# EAGLE design precharge (EAGLE 6.5.0)
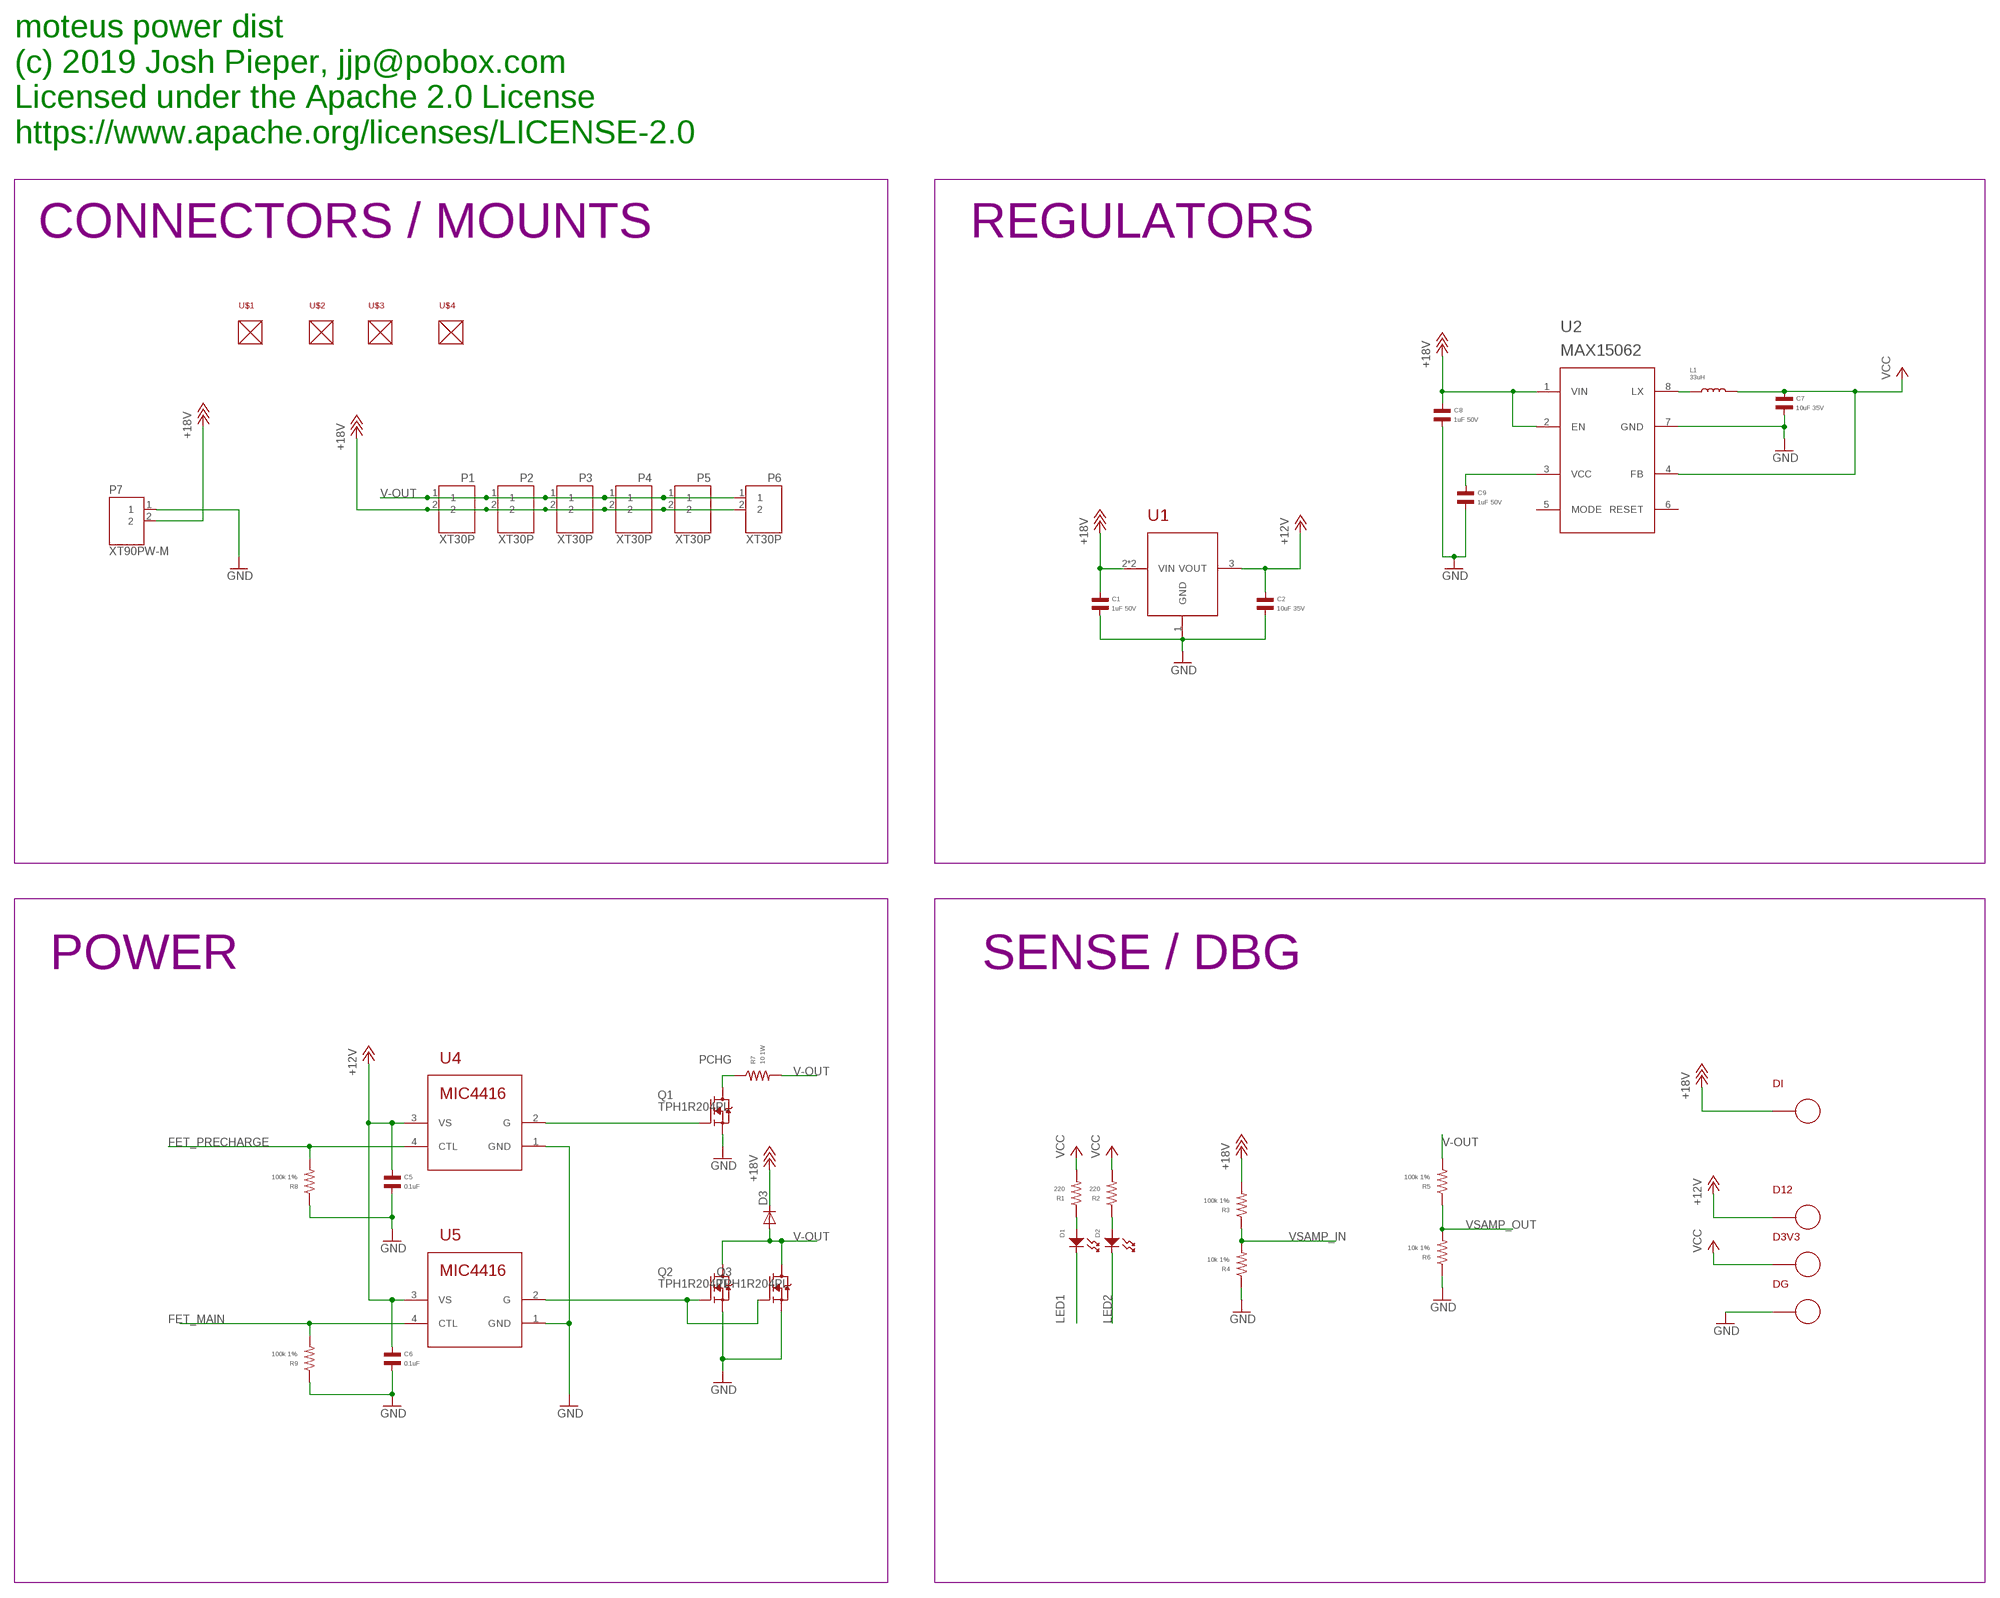
[diagram p0: schematic, sheet 1, part 1 of 2]
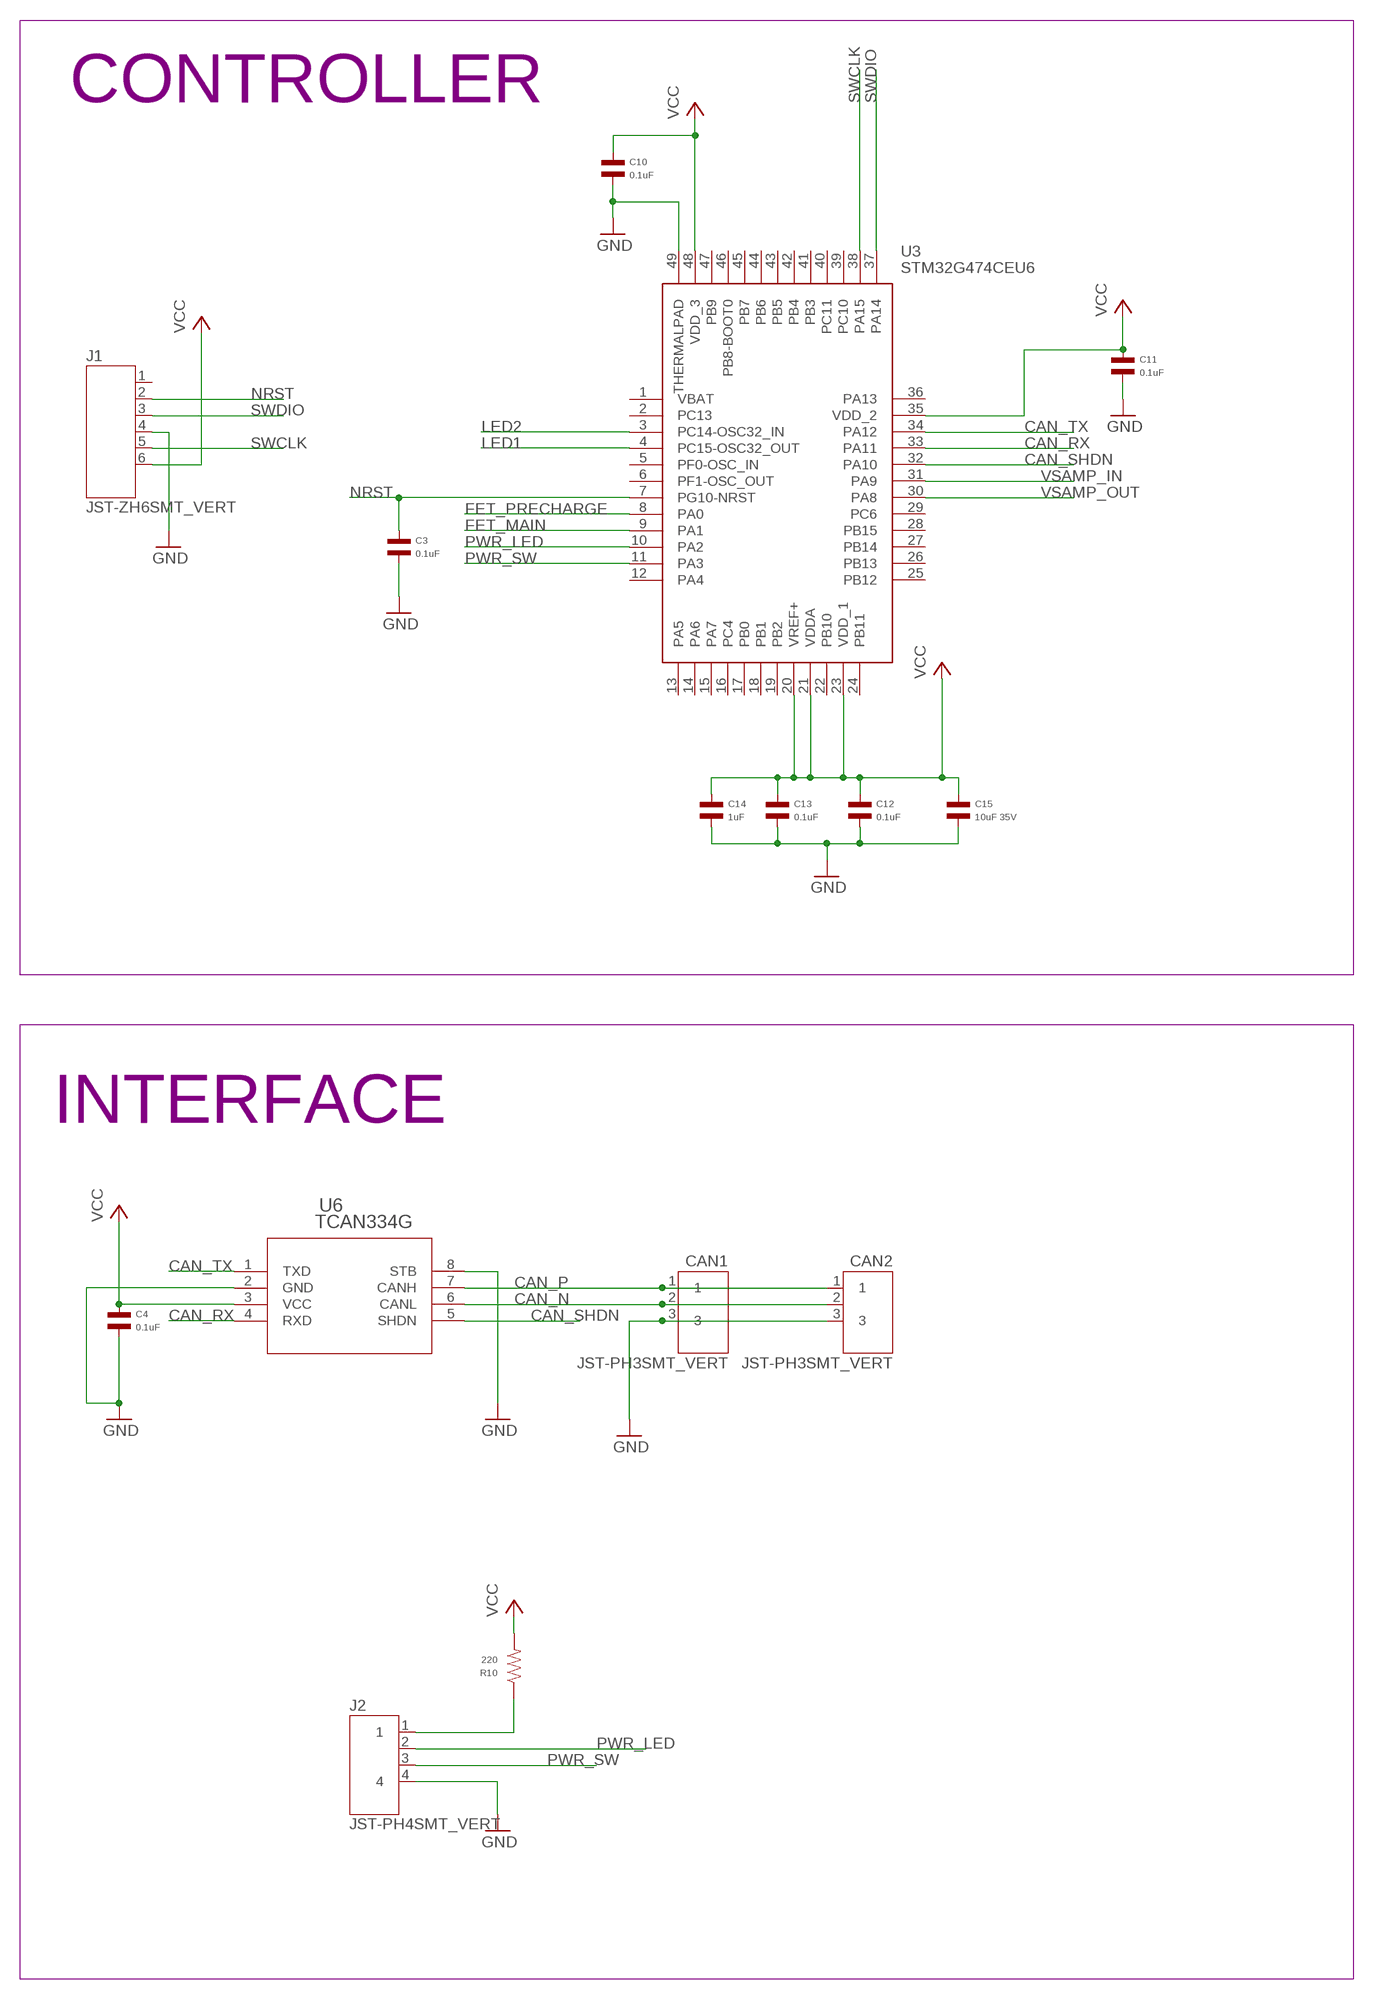
[diagram p1: schematic, sheet 1, part 2 of 2]

## Parts
C1  1uF 50V  CAPACITOR_NP_0603  [C0603]
C2  10uF 35V  CAPACITOR_NP_1206  [C1206]
C3  0.1uF  CAPACITOR_NP_0402  [C0402]
C4  0.1uF  CAPACITOR_NP_0402  [C0402]
C5  0.1uF  CAPACITOR_NP_0402  [C0402]
C6  0.1uF  CAPACITOR_NP_0402  [C0402]
C7  10uF 35V  CAPACITOR_NP_1206  [C1206]
C8  1uF 50V  CAPACITOR_NP_0603  [C0603]
C9  1uF 50V  CAPACITOR_NP_0603  [C0603]
C10  0.1uF  CAPACITOR_NP_0402  [C0402]
C11  0.1uF  CAPACITOR_NP_0402  [C0402]
C12  0.1uF  CAPACITOR_NP_0402  [C0402]
C13  0.1uF  CAPACITOR_NP_0402  [C0402]
C14  1uF  CAPACITOR_NP_0402  [C0402]
C15  10uF 35V  CAPACITOR_NP_1206  [C1206]
CAN1  JST-PH3SMT_VERT  [JST_B3B_PH-SM4-TB(LF)(SN)]
CAN2  JST-PH3SMT_VERT  [JST_B3B_PH-SM4-TB(LF)(SN)]
D1  LED_SINGLE-0603  [LED0603]
D2  LED_SINGLE-0603  [LED0603]
D3  DIODE-  [DO-214AB]
D3V3  PAD24AWG_PAD  [24AWG_PAD]
D12  PAD24AWG_PAD  [24AWG_PAD]
DG  PAD24AWG_PAD  [24AWG_PAD]
DI  PAD24AWG_PAD  [24AWG_PAD]
J1  JST-ZH6SMT_VERT  [JST_B6B-ZR-SM4-TF(LF)(SN)]
J2  JST-PH4SMT_VERT  [JST_B4B_PH-SM4-TB(LF)(SN)]
L1  33uH  INDUCTOR_1210  [L1210]
P1  XT30P  [XT30P]
P2  XT30P  [XT30P]
P3  XT30P  [XT30P]
P4  XT30P  [XT30P]
P5  XT30P  [XT30P]
P6  XT30P  [XT30P]
P7  XT90PW-M  [XT90PW-M]
Q1  TPH1R204PL  [SOP_ADVANCE]
Q2  TPH1R204PL  [SOP_ADVANCE]
Q3  TPH1R204PL  [SOP_ADVANCE]
R1  220  RESISTOR_0603  [R0603]
R2  220  RESISTOR_0603  [R0603]
R3  100k 1%  RESISTOR_0603  [R0603]
R4  10k 1%  RESISTOR_0603  [R0603]
R5  100k 1%  RESISTOR_0603  [R0603]
R6  10k 1%  RESISTOR_0603  [R0603]
R7  10 1W  RESISTOR_1206  [R1206]
R8  100k 1%  RESISTOR_0603  [R0603]
R9  100k 1%  RESISTOR_0603  [R0603]
R10  220  RESISTOR_0603  [R0603]
U1  ZXTR2012Z  [SOT89]
U2  MAX150628TDFN  [8TDFN]
U3  STM32G474CEU6  [QFN50P700X700X60-49N]
U4  MIC4416  [SOT143]
U5  MIC4416  [SOT143]
U6  TCAN334G  [SOIC8]
U$1  MOUNT  [M2.5MOUNT]
U$2  MOUNT  [M2.5MOUNT]
U$3  MOUNT  [M2.5MOUNT]
U$4  MOUNT  [M2.5MOUNT]

## Nets
+12V [power]: C2.P$1 C5.P$1 C6.P$1 D12.P$1 U1.3(VOUT) U4.3(VS) U5.3(VS)
+18V: C1.P$1 C8.P$1 D3.C DI.P$1 P1.2 P2.2 P3.2 P4.2 P5.2 P6.2 P7.2 R3.P$2 U1.2(VIN) U1.PAD(VIN) U2.1(VIN) U2.2(EN)
CAN_N: CAN1.2 CAN2.2 U6.6(CANL)
CAN_P: CAN1.1 CAN2.1 U6.7(CANH)
CAN_RX: U3.33(PA11) U6.4(RXD)
CAN_SHDN: U3.32(PA10) U6.5(SHDN)
CAN_TX: U3.34(PA12) U6.1(TXD)
FET_MAIN: R9.P$2 U3.9(PA1) U5.4(CTL)
FET_PRECHARGE: R8.P$2 U3.8(PA0) U4.4(CTL)
GND: C1.P$2 C2.P$2 C3.P$2 C4.P$2 C5.P$2 C6.P$2 C7.P$2 C8.P$2 C9.P$2 C10.P$2 C11.P$2 C12.P$2 C13.P$2 C14.P$2 C15.P$2 CAN1.3 CAN2.3 DG.P$1 J1.4 J2.4 P7.1 Q1.1(S) Q1.2(S) Q1.3(S) Q2.1(S) Q2.2(S) Q2.3(S) Q3.1(S) Q3.2(S) Q3.3(S) R4.P$1 R6.P$1 R8.P$1 R9.P$1 U1.1(GND) U2.7(GND) U3.49(THERMALPAD) U4.1(GND) U5.1(GND) U6.2(GND) U6.8(STB)
LED1: D1.CATHODE U3.4(PC15-OSC32_OUT)
LED2: D2.CATHODE U3.3(PC14-OSC32_IN)
LX: L1.P$1 U2.8(LX)
N$1: D1.ANODE R1.P$1
N$2: J2.1 R10.P$1
N$3: Q2.4(G) Q3.4(G) U5.2(G)
N$4: D2.ANODE R2.P$1
N$12: Q1.4(G) U4.2(G)
N$13: C9.P$1 U2.3(VCC)
NRST: C3.P$1 J1.2 U3.7(PG10-NRST)
PCHG: Q1.5(D) Q1.6(D) Q1.7(D) Q1.8(D) Q1.PAD(D) R7.P$1
PWR_LED: J2.2 U3.10(PA2)
PWR_SW: J2.3 U3.11(PA3)
SWCLK: J1.5 U3.38(PA15)
SWDIO: J1.3 U3.37(PA14)
V-OUT: D3.A P1.1 P2.1 P3.1 P4.1 P5.1 P6.1 Q2.5(D) Q2.6(D) Q2.7(D) Q2.8(D) Q2.PAD(D) Q3.5(D) Q3.6(D) Q3.7(D) Q3.8(D) Q3.PAD(D) R5.P$2 R7.P$2
VCC [power]: C4.P$1 C7.P$1 C10.P$1 C11.P$1 C12.P$1 C13.P$1 C14.P$1 C15.P$1 D3V3.P$1 J1.6 L1.P$2 R1.P$2 R2.P$2 R10.P$2 U2.4(FB) U3.20(VREF+) U3.21(VDDA) U3.23(VDD_1) U3.35(VDD_2) U3.48(VDD_3) U6.3(VCC)
VSAMP_IN: R3.P$1 R4.P$2 U3.31(PA9)
VSAMP_OUT: R5.P$1 R6.P$2 U3.30(PA8)
Unconnected: J1.1 U2.5(MODE) U2.6(RESET) U3.1(VBAT) U3.2(PC13) U3.5(PF0-OSC_IN) U3.6(PF1-OSC_OUT) U3.12(PA4) U3.13(PA5) U3.14(PA6) U3.15(PA7) U3.16(PC4) U3.17(PB0) U3.18(PB1) U3.19(PB2) U3.22(PB10) U3.24(PB11) U3.25(PB12) U3.26(PB13) U3.27(PB14) U3.28(PB15) U3.29(PC6) U3.36(PA13) U3.39(PC10) U3.40(PC11) U3.41(PB3) U3.42(PB4) U3.43(PB5) U3.44(PB6) U3.45(PB7) U3.46(PB8-BOOT0) U3.47(PB9)

## Notes on the sheet
- moteus power dist
  (c) 2019 Josh Pieper, jjp@pobox.com
  Licensed under the Apache 2.0 License
  https://www.apache.org/licenses/LICENSE-2.0
- CONNECTORS / MOUNTS | REGULATORS | CONTROLLER
- POWER | SENSE / DBG | INTERFACE

## Library data of the parts
C1 C8 C9 = mfpassives:CAPACITOR_NP: Library: MF_Passives Description: Device for Non-Polarized Capacitors. Manufacture part number (MPN) can be added via Attributes. Check https://factory.macrofab.com/parts for the house parts list.; MF: SAMSUNG; MPN: CL10A105KB8NNNC; POPULATE: 1
C2 C7 C15 = mfpassives:CAPACITOR_NP: Library: MF_Passives Description: Device for Non-Polarized Capacitors. Manufacture part number (MPN) can be added via Attributes. Check https://factory.macrofab.com/parts for the house parts list.; MF: TDK; MPN: CGA5L1X7R1V106K160AC; POPULATE: 1
C3-C6 C10-C13 = mfpassives:CAPACITOR_NP: Library: MF_Passives Description: Device for Non-Polarized Capacitors. Manufacture part number (MPN) can be added via Attributes. Check https://factory.macrofab.com/parts for the house parts list.; HOUSEPART: 1; MPN: MF-CAP-0402-0.1uF; POPULATE: 1
C14 = mfpassives:CAPACITOR_NP: Library: MF_Passives Description: Device for Non-Polarized Capacitors. Manufacture part number (MPN) can be added via Attributes. Check https://factory.macrofab.com/parts for the house parts list.; HOUSEPART: 1; MPN: MF-CAP-0402-1uF; POPULATE: 1
CAN1 CAN2 = precharge:JST-PH3; MF: JST; MPN: B3B-PH-SM4-TB(LF)(SN); POPULATE: 1
D1 D2 = mfleds:LED_SINGLE: Library: MF_LEDs Description: Device for Single LED Packages. Manufacture part number (MFG#) can be added via Attributes.; HOUSEPART: 1; MPN: MF-LED-0603-RED; POPULATE: 1
D3 = imu_junction:DIODE-: DIODE; MF: MICRO COMMERCIAL; MPN: SK510L-TP; POPULATE: 1
D3V3 D12 DG DI = precharge:PAD; POPULATE: 0
J1 = precharge:JST-ZH6; MF: JST; MPN: B6B-ZR-SM4-TF(LF)(SN); POPULATE: 1
J2 = precharge:JST-PH4; MF: JST; MPN: B4B-PH-SM4-TB(LF)(SN); POPULATE: 1
L1 = mfpassives:INDUCTOR: Library: MF_Passives Description: Device for Inductors. Manufacture part number (MPN) can be added via Attributes. Check https://factory.macrofab.com/parts for the house parts list.; MF: TDK; MPN: NLFV32T-330K-EF; POPULATE: 1
P1-P6 = precharge:XT30; POPULATE: 0
P7 = precharge:XT90; POPULATE: 0
Q1-Q3 = imu_junction:TPH1R204PL; MF: Toshiba; MPN: TPH1R204PL,L1Q; POPULATE: 1
R1 R2 R10 = mfpassives:RESISTOR: Library: MF_Passives Description: Device for Resistors. Manufacture part number (MPN), Voltage, Tolerance, and Wattage Rating can be added via Attributes. Check https://factory.macrofab.com/parts for the house parts list.; HOUSEPART: 1; MPN: MF-RES-0603-220; POPULATE: 1
R3 R5 R8 R9 = mfpassives:RESISTOR: Library: MF_Passives Description: Device for Resistors. Manufacture part number (MPN), Voltage, Tolerance, and Wattage Rating can be added via Attributes. Check https://factory.macrofab.com/parts for the house parts list.; MF: VISHAY; MPN: CRCW0603100KFKEA; POPULATE: 1
R4 R6 = mfpassives:RESISTOR: Library: MF_Passives Description: Device for Resistors. Manufacture part number (MPN), Voltage, Tolerance, and Wattage Rating can be added via Attributes. Check https://factory.macrofab.com/parts for the house parts list.; MF: PANASONIC; MPN: P10.0KHDKR-ND; POPULATE: 1
R7 = mfpassives:RESISTOR: Library: MF_Passives Description: Device for Resistors. Manufacture part number (MPN), Voltage, Tolerance, and Wattage Rating can be added via Attributes. Check https://factory.macrofab.com/parts for the house parts list.; MF: Susumu; MPN: HRG3216Q-10R0-D-T1; POPULATE: 1
U1 = imu_junction:ZXTR2012Z; MF: DIODES INC; MPN: ZXTR2012Z-13; POPULATE: 1
U2 = precharge:MAX15062; MF: MAXIM; MPN: MAX15062AATA+T; POPULATE: 1
U3 = precharge:STM32G474CEU6: STMICROELECTRONICS - STM32G474CEU6 - MCU, 32BIT, 170MHZ, UFQFPN-48 Source: Datasheet <https://componentsearchengine.com/Datasheets/1/STM32G474CEU6.pdf>; DESCRIPTION: STMICROELECTRONICS - STM32G474CEU6 - MCU, 32BIT, 170MHZ, UFQFPN-48; HEIGHT: 0.6mm; MANUFACTURER_NAME: STMicroelectronics; MANUFACTURER_PART_NUMBER: STM32G474CEU6; MF: ST; MOUSER_PART_NUMBER: 511-STM32G474CEU6; MOUSER_PRICE-STOCK: https://www.mouser.com/Search/Refine.aspx?Keyword=511-STM32G474CEU6; MPN: STM32G474CEU6; POPULATE: 1
U4 U5 = imu_junction:MIC4416; MF: MICROCHIP; MPN: MIC4416YM4-TR; POPULATE: 1
U6 = precharge:TCAN334G; MF: TI; MPN: TCAN334GDR; POPULATE: 1
U$1-U$4 = precharge:MOUNT; POPULATE: 0

## Net classes
1 power: width 0.254 mm

## Board
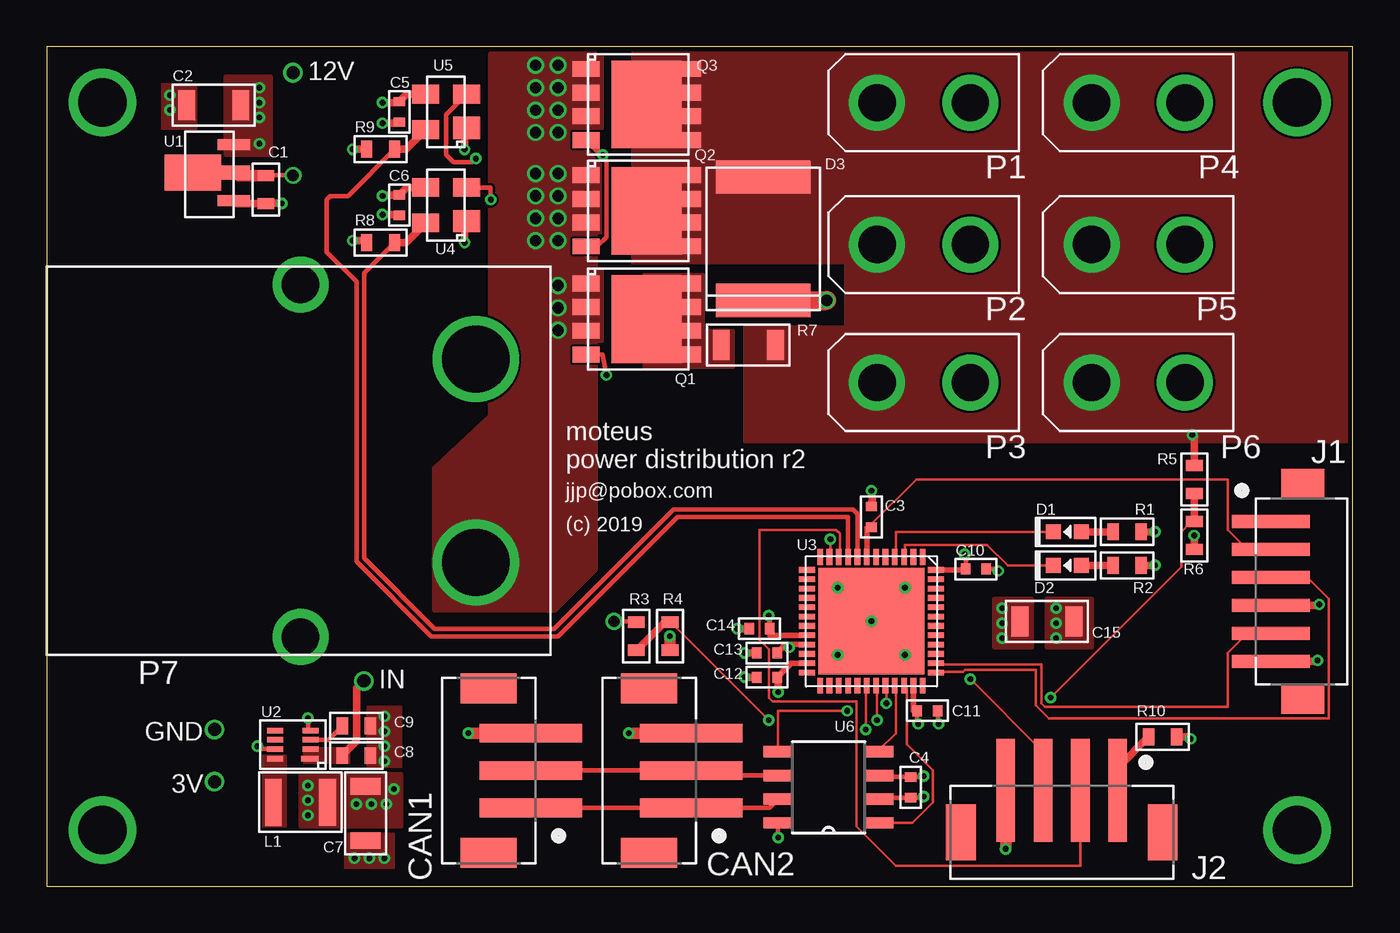
[diagram p2: board, top side]
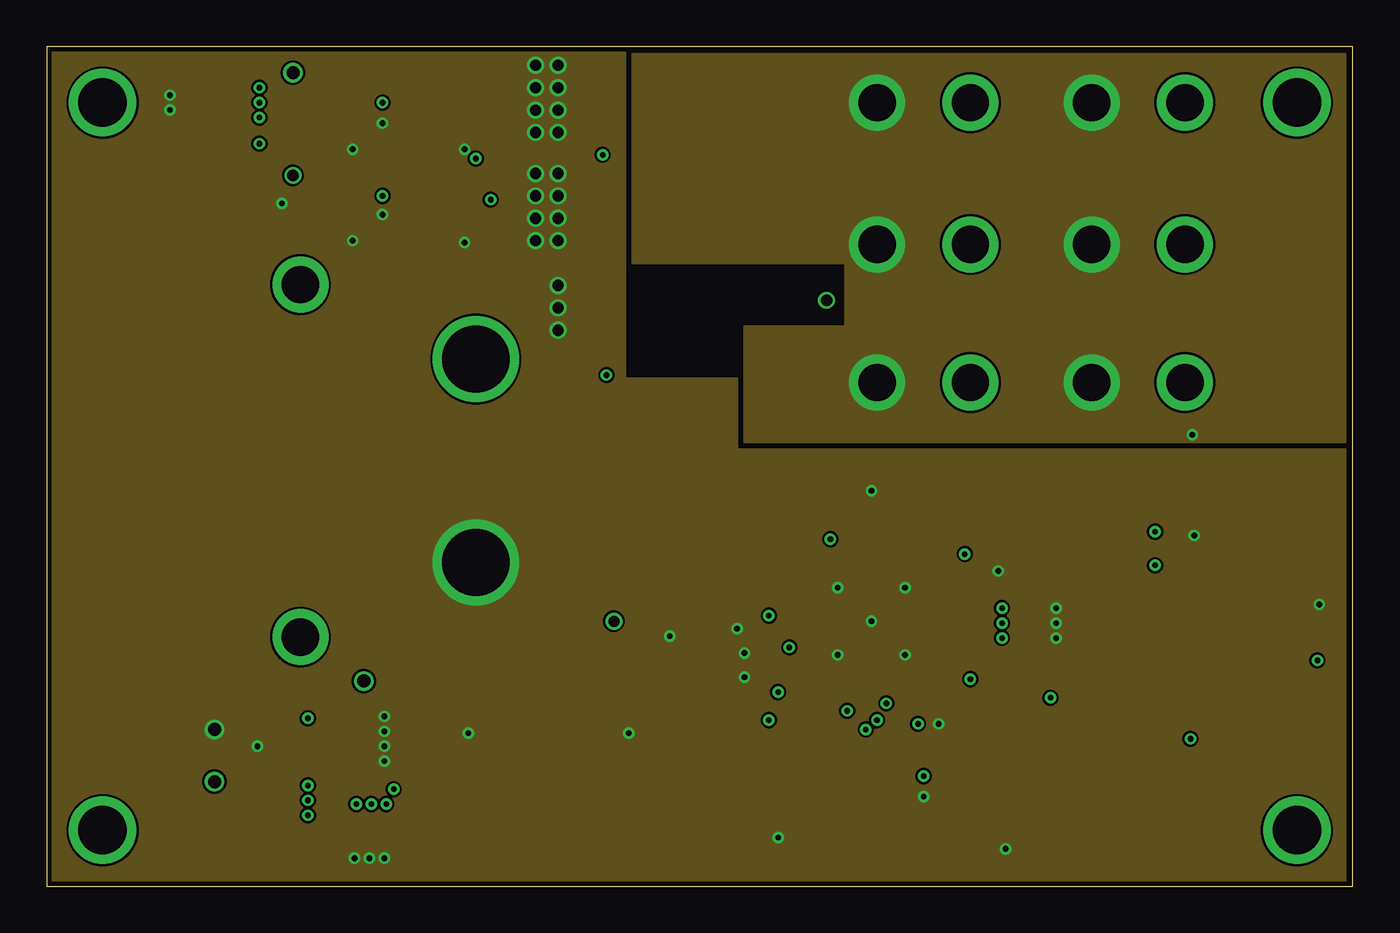
[diagram p3: board, inner layer Route2]
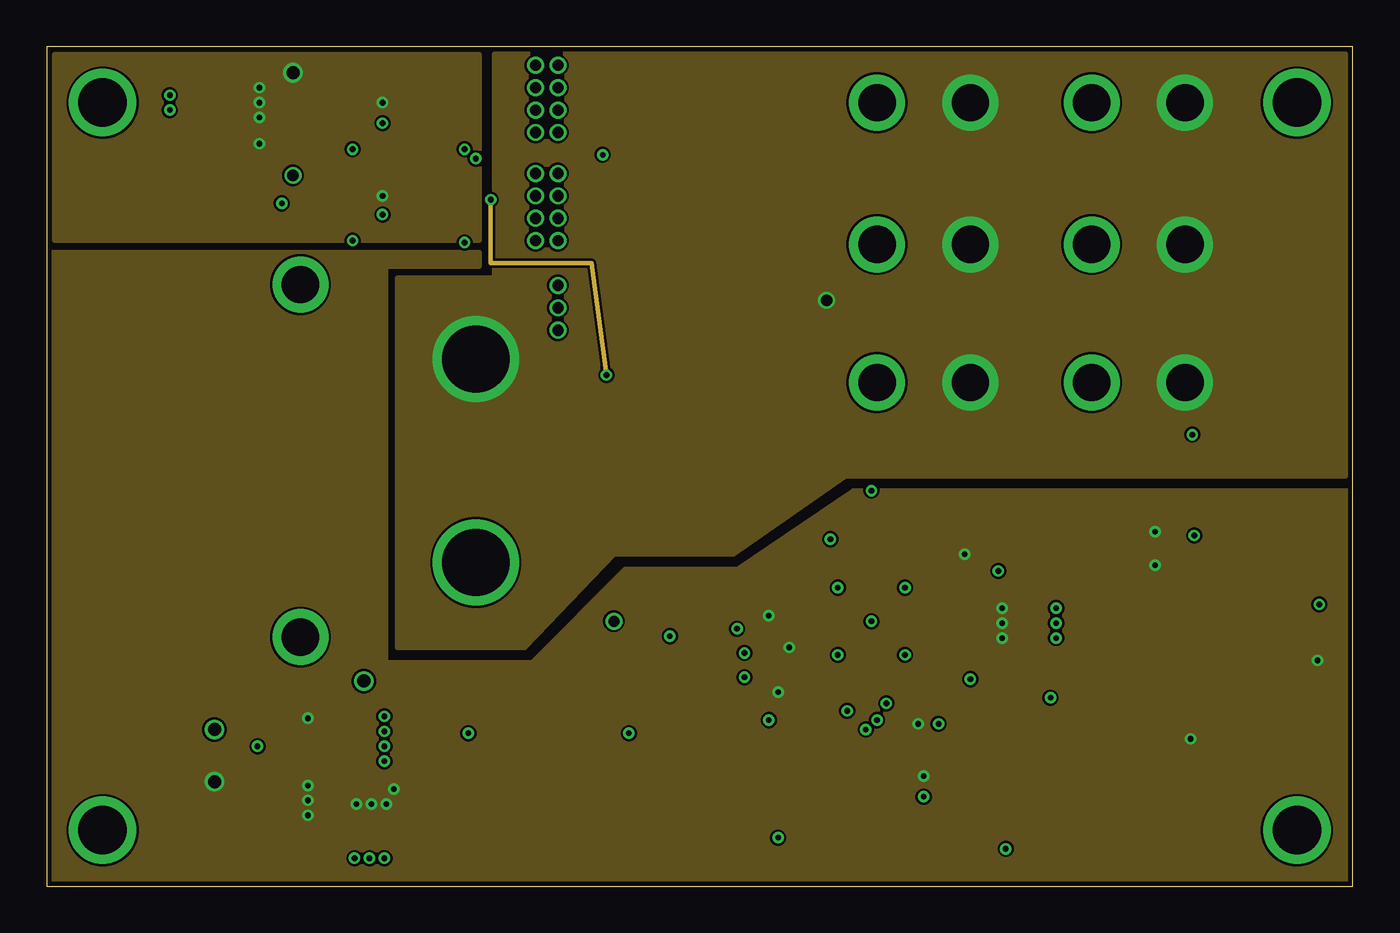
[diagram p4: board, inner layer Route15]
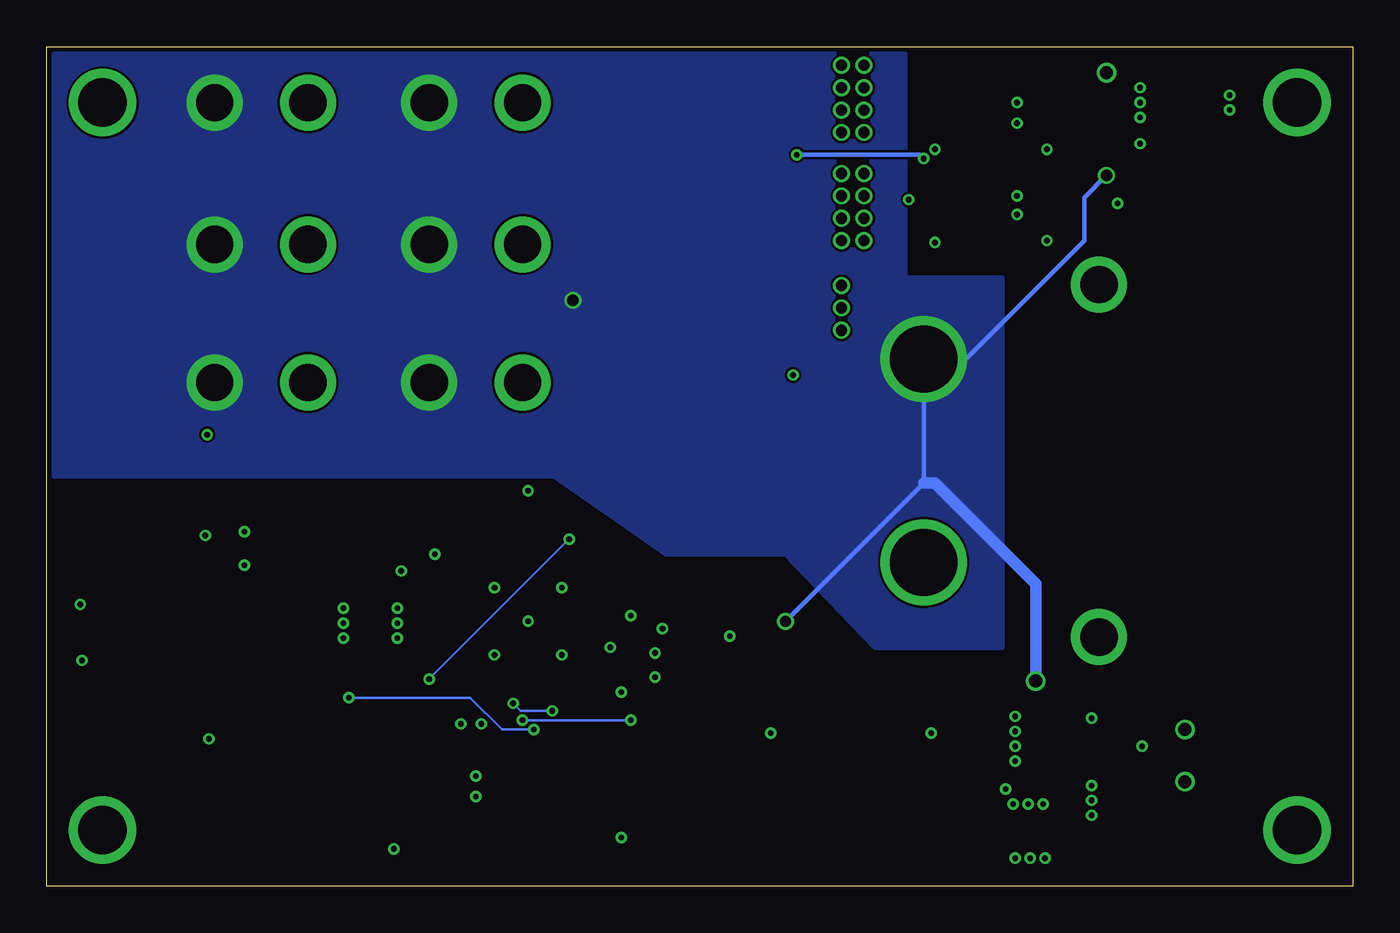
[diagram p5: board, bottom side, seen from below]

Size 70 x 45 mm. Coordinates in mm from the lower left corner, seen from the top.
Outline: 0,0 70,0 70,45 0,45 0,0
Copper layers (1*2*15*16): Top 0.035mm / dielectric 0.23mm / Route2 0.035mm / dielectric 0.93mm / Route15 0.035mm / dielectric 0.23mm / Bottom 0.035mm
Design rules "MF_Standard_4_Layer": minimum track width 5mil, minimum drill 12mil, track to track 5mil, track to pad 5mil, pad to pad 5mil, via to via 5mil, smd to smd 0mil, copper to edge 10mil, drill to drill 10mil, minimum pad ring 6mil, minimum via ring 6mil, stop-mask expansion 2mil, vias tented up to drill 25mil, thermal gap 10mil

### Footprints (pad centres in the part's own frame; a part is rotated, then mirrored left to right if it is on the bottom)
C0603 = smd 0.6 x 0.9: P$1 -0.75,0; P$2 0.75,0
C1206 = smd 0.9 x 1.6: P$1 -1.45,0; P$2 1.45,0
C0402 = smd 0.5 x 0.6: P$1 -0.55,0; P$2 0.55,0
JST_B3B_PH-SM4-TB(LF)(SN) = smd 1 x 5.5: 1 -2,-2.54; 2 0,-2.54; 3 2,-2.54 | smd 1.6 x 3: P1 -4.4,-0.29; P2 4.4,-0.29
LED0603 = smd 0.8 x 0.8: ANODE 0.75,0; CATHODE -0.75,0
DO-214AB = smd 1.778 x 5.08: A 3.302,0; C -3.302,0
24AWG_PAD = drill 0.7: P$1 0,0
JST_B6B-ZR-SM4-TF(LF)(SN) = smd 0.7 x 4.2: 1 -3.75,-2; 2 -2.25,-2; 3 -0.75,-2; 4 0.75,-2; 5 2.25,-2; 6 3.75,-2 | smd 1.5 x 2.3: P1 -5.8,-0.29; P2 5.8,-0.29
JST_B4B_PH-SM4-TB(LF)(SN) = smd 1 x 5.5: 1 -3,-2.54; 2 -1,-2.54; 3 1,-2.54; 4 3,-2.54 | smd 1.6 x 3: P1 -5.4,-0.29; P2 5.4,-0.29
L1210 = smd 0.9 x 2.5: P$1 -1.45,0; P$2 1.45,0
XT30P = drill 2: 1 -2.5,0; 2 2.5,0
XT90PW-M = drill 3.6: 1 -5.45,0; 2 5.45,0 | drill 2: S1 -9.45,9.4; S2 9.45,9.4
SOP_ADVANCE = smd 0.85 x 1.45: 1 -1.905,-2.8; 2 -0.635,-2.8; 3 0.635,-2.8; 4 1.905,-2.8 | smd 0.85 x 1.05: 5 1.905,2.85; 6 0.635,2.85; 7 -0.635,2.85; 8 -1.905,2.85 | smd 4.7 x 3.75: PAD 0,0.45
R0603 = smd 0.6 x 0.9: P$1 -0.75,0; P$2 0.75,0
R1206 = smd 0.9 x 1.6: P$1 -1.45,0; P$2 1.45,0
SOT89 = smd 0.58 x 1.73: 1 -1.5,-1.2; 3 1.5,-1.2 | smd 0.76 x 1.55: 2 0,-1.29 | smd 1.933 x 3.03: PAD 0,1
8TDFN = smd 0.3 x 0.95: 1 -0.75,-0.9 | smd 0.3 x 0.85: 2 -0.25,-0.95; 3 0.25,-0.95; 4 0.75,-0.95; 5 0.75,0.95; 6 0.25,0.95; 7 -0.25,0.95; 8 -0.75,0.95
QFN50P700X700X60-49N = smd 0.85 x 0.3: 1 -3.45,2.75; 2 -3.45,2.25; 3 -3.45,1.75; 4 -3.45,1.25; 5 -3.45,0.75; 6 -3.45,0.25; 7 -3.45,-0.25; 8 -3.45,-0.75; 9 -3.45,-1.25; 10 -3.45,-1.75; 11 -3.45,-2.25; 12 -3.45,-2.75; 25 3.45,-2.75; 26 3.45,-2.25; 27 3.45,-1.75; 28 3.45,-1.25; 29 3.45,-0.75; 30 3.45,-0.25; 31 3.45,0.25; 32 3.45,0.75; 33 3.45,1.25; 34 3.45,1.75; 35 3.45,2.25; 36 3.45,2.75 | smd 0.3 x 0.85: 13 -2.75,-3.45; 14 -2.25,-3.45; 15 -1.75,-3.45; 16 -1.25,-3.45; 17 -0.75,-3.45; 18 -0.25,-3.45; 19 0.25,-3.45; 20 0.75,-3.45; 21 1.25,-3.45; 22 1.75,-3.45; 23 2.25,-3.45; 24 2.75,-3.45; 37 2.75,3.45; 38 2.25,3.45; 39 1.75,3.45; 40 1.25,3.45; 41 0.75,3.45; 42 0.25,3.45; 43 -0.25,3.45; 44 -0.75,3.45; 45 -1.25,3.45; 46 -1.75,3.45; 47 -2.25,3.45; 48 -2.75,3.45 | smd 5.7 x 5.7: 49 0,0
SOT143 = smd 1.2 x 1.44: 1 -0.85,-1.1 | smd 1 x 1.44: 2 0.95,-1.1; 3 0.95,1.1; 4 -0.95,1.1
SOIC8 = smd 1.549 x 0.61: 1 -2.7,1.905; 2 -2.7,0.635; 3 -2.7,-0.635; 4 -2.7,-1.905; 5 2.7,-1.905; 6 2.7,-0.635; 7 2.7,0.635; 8 2.7,1.905
M2.5MOUNT = drill 2.6: P$1 0,0

### Placement (x,y rotation side)
C1  11.75,37.34 270 top
C2  8.96,41.86 180 top
C3  44.2,19.8 90 top
C4  46.3,5.3 270 top
C5  18.9,41.5 270 top
C6  18.9,36.5 270 top
C7  17.1,3.9 270 top
C8  16.6,7 0 top
C9  16.6,8.6 0 top
C10  49.8,17 0 top
C11  47.2,9.4 0 top
C12  38.6,11.2 180 top
C13  38.6,12.5 180 top
C14  38.2,13.8 180 top
C15  53.6,14.2 0 top
CAN1  23.4,6.2 90 top
CAN2  32,6.2 90 top
D1  54.7,19 0 top
D2  54.7,17.2 0 top
D3  38.4,34.7 90 top
D3V3  9,5.6 0 top
D12  13.2,43.6 0 top
DG  9,8.4 0 top
DI  17,11 0 top
J1  67.6,15.8 270 top
J2  54.4,2.6 180 top
L1  13.6,4.5 0 top
P1  47,42 0 top
P2  47,34.4 0 top
P3  47,27 0 top
P4  58.5,42 0 top
P5  58.5,34.4 0 top
P6  58.5,27 0 top
P7  23,22.8 90 top
Q1  31.7,30.4 270 top
Q2  31.7,36.2 270 top
Q3  31.7,41.9 270 top
R1  57.9,19 0 top
R2  57.9,17.2 0 top
R3  31.6,13.4 90 top
R4  33.4,13.4 90 top
R5  61.5,21.8 90 top
R6  61.5,18.8 90 top
R7  37.6,29 0 top
R8  17.9,34.5 0 top
R9  17.9,39.5 0 top
R10  59.8,8 0 top
U1  8.83,38.25 90 top
U2  13.2,7.6 90 top
U3  44.2,14.2 270 top
U4  21.4,36.5 90 top
U5  21.4,41.5 90 top
U6  41.9,5.3 180 top
U$1  67,42 0 top
U$2  3,42 0 top
U$3  3,3 0 top
U$4  67,3 0 top

### Tracks (layer width: path | path; a pad name or v marks a point on that pad's centre or on a via)
+12V  (via drill 0.3)
  Top 0.406: v18,42 18.85,42 C5.P$1 19.3,42.45 U5.3 | v18,37 18.05,37.05 C6.P$1 19.3,37.45 U4.3
  other vias: 11.4,39.8 11.4,41.2 11.4,42 11.4,42.8
  pour Route15 (no thermals): 0.4,44.6 23.2,44.6 23.2,34.6 0.4,34.6
  pour Top (no thermals): 9.6,39.2 9.6,43.4 12,43.4 12,39.2
+18V  (via drill 0.6)
  Top 0.254: v13.2,38.1 C1.P$1 | v30.4,14.2 31.55,14.2 R3.P$2
  Top 0.406: DI.P$1 16.6,10.6 16.6,7.8 15.85,7.05 C8.P$1
  Top 0.61: C1.P$1 10.28,38.09 U1.2 U1.PAD
  Top 1.016: D3.C v41.8,31.4
  Bottom 0.254: v13.2,38.1 14.4,36.9 14.4,34.6 20.75,28.25 P7.2 23,21.6 v30.4,14.2
  Bottom 0.61: 23,21.6 22.4,21.6 17,16.2 DI.P$1
  pour Top (no thermals): 13.8,7.4 16.2,7.4 16.2,6.6 13.8,6.6
  pour Route15 (no thermals): 18.8,32.6 24,32.6 24,44.6 69.6,44.6 69.6,22 42.8,22 36.8,17.8 30.4,17.8 25.6,12.8 18.8,12.8
  pour Bottom (no thermals): 18.8,32.6 24,32.6 24,44.6 69.6,44.6 69.6,22 42.8,22 36.8,17.8 30.4,17.8 25.6,12.8 18.8,12.8
CAN_N
  Top 0.127: 34.8,5.93 CAN2.2
  Top 0.254: U6.6 34.8,5.93 | CAN2.2 CAN1.2
CAN_P
  Top 0.254: U6.7 38.73,4.2 CAN2.1 CAN1.1
CAN_RX
  Top 0.127: U3.33 45.5,10.7 45.5,8.2 44.6,7.3 U6.4
CAN_SHDN  (via drill 0.3)
  Top 0.127: v45,9.8 45,10.7 U3.32 | v42.9,9.4 39.2,9.4 U6.5
  Bottom 0.127: v45,9.8 44.6,9.4 v42.9,9.4
CAN_TX
  Top 0.127: U3.34 46.1,10.6 46.1,7.6 47.5,6.2 47.5,4.5 46.4,3.4 U6.1
FET_MAIN
  Top 0.254: U3.9 42.95,19.8 33.8,19.8 27.4,13.4 20.6,13.4 16.6,17.4 16.6,32.4 15,34 15,36.8 15.2,37 16.15,37 R9.P$2
  Top 0.406: R9.P$2 19.25,39.5 U5.4
FET_PRECHARGE
  Top 0.254: U3.8 43.45,19.95 43.2,20.2 33.6,20.2 27.2,13.8 20.8,13.8 17,17.6 17,32.85 R8.P$2
  Top 0.406: R8.P$2 19.25,34.5 U4.4
GND  (via drill 0.3, 0.6)
  Top 0.254: U2.7 11.3,7.35 v11.3,7.5 | C11.P$2 47.75,8.75 arc90 v47.8,8.7 | v47,4.8 46.95,4.75 C4.P$2 44.69,4.75 U6.2 | U6.8 v39.2,2.6 | C10.P$2 50.9,17 v51,16.9
  Top 0.406: C3.P$2 44.25,20.75 v44.2,21.2 | v61.5,18.8 R6.P$1 | J1.4 68.15,15.05 v68.2,15.1 | U1.1 10.19,36.59 C1.P$2 v12.6,36.6 | C5.P$2 18.85,40.9 v18,40.9 | R9.P$1 v16.4,39.5 | R8.P$1 17.05,34.6 v16.4,34.6 | C6.P$2 18.85,36 v18,36 | U5.1 22.4,40.55 v22.4,39.5 | U4.1 22.4,35.55 v22.4,34.5 | C12.P$2 v37.4,11.2 | C13.P$2 v37.4,12.5 | C14.P$2 v37,13.8
  Top 0.61: CAN1.3 v22.6,8.2 | v31.2,8.2 CAN2.3 | R4.P$1 v33.4,13.4 | J2.4 v51.4,2
  other vias: 27.4,44 27.4,42.8 27.4,41.6 27.4,38.2 27.4,37 27.4,35.8 27.4,32.2 27.4,31 27.4,29.8 27.4,40.4 27.4,34.6 26.2,44 26.2,42.8 26.2,41.6 26.2,40.4 26.2,38.2 26.2,37 26.2,35.8 26.2,34.6 16.5,1.5 17.3,1.5 18.1,1.5 18.1,6.7 18.1,7.5 18.1,8.3 18.1,9.1 44.2,14.2 54.1,14.9 54.1,14.1 54.1,13.3 6.6,41.6 6.6,42.4 46,16 46,12.4 42.4,12.4 42.4,16
  pour Route2 (no thermals): 0.2,44.8 31,44.8 31,27.2 37,27.2 37,23.4 69.6,23.4 69.6,0.2 0.2,0.2
  pour Top (no thermals): 25.6,44.6 29.8,44.6 29.8,40.6 28,40.6 28,39.8 25.6,39.8
  pour Top (no thermals): 25.6,38.8 29.8,38.8 29.8,35 28,35 28,34 25.6,34
  pour Top (no thermals): 26.8,33 29.8,33 29.8,29.2 26.8,29.2
  pour Top (no thermals): 16,2.8 18.6,2.8 18.6,1 16,1
  pour Top (no thermals): 17.2,9.6 19,9.6 19,6.4 17.2,6.4
  pour Top (no thermals): 53.6,15.4 56,15.4 56,12.8 53.6,12.8
  pour Top (no thermals): 6.2,43 8,43 8,40.6 6.2,40.6
  pour Top (no thermals): 20.8,22.4 23.8,25.2 23.8,44.6 29.4,44.6 29.4,17 27.2,14.8 20.8,14.8
LED1
  Top 0.127: D1.CATHODE 45.5,19 45.5,17.7 U3.4
LED2
  Top 0.127: D2.CATHODE 51.5,17.2 50.4,18.3 46,18.3 46,17.7 U3.3
LX
  pour Top (no thermals): 11.6,7 12.8,7 12.8,3.2 11.6,3.2
N$1
  Top 0.406: R1.P$1 D1.ANODE
N$2
  Top 0.406: R10.P$1 57.4,6.35 J2.1
N$3  (via drill 0.3)
  Top 0.254: Q2.4 29.5,34.3 30,34.8 30,38.9 Q3.4 29,39.99 v29.8,39.2 | v23,39 22.8,38.8 21.8,38.8 21.4,39.2 21.4,41.35 U5.2
  Bottom 0.254: v29.8,39.2 23.2,39.2 v23,39
N$4
  Top 0.406: R2.P$1 D2.ANODE
N$12  (via drill 0.3)
  Top 0.254: U4.2 23.8,37.45 v23.8,36.8 | v30,27.4 29.8,28.5 Q1.4
  Route15 0.254: v23.8,36.8 23.8,33.4 29.2,33.4 v30,27.4
N$13
  Top 0.254: U2.3 15.1,7.85 C9.P$1
NRST
  Top 0.127: C3.P$1 44.1,19.3 46.6,21.8 63.3,21.8 63.3,19.1 64.3,18.1 65.6,18.1 J1.2
  Top 0.254: 43.95,19.2 arc-90 C3.P$1
  Top 0.305: 43.95,19.2 U3.7
PCHG
  pour Top (no thermals): 32,32.8 35.2,32.8 35.2,29.8 36.8,29.8 36.8,27.8 32,27.8
PWR_LED
  Top 0.127: J2.2 55.4,1.1 45.5,1.1 43.4,3.2 43.4,9.9 38.9,9.9 38.7,10.1 38.7,12.7 38.2,13.2 38.2,19.1 42.3,19.1 42.5,18.9 42.5,17.7 U3.10
PWR_SW  (via drill 0.3)
  Top 0.127: v42,18.6 42,17.7 U3.11 | v49.5,11.1 53.4,7.2 J2.3
  Bottom 0.127: v49.5,11.1 v42,18.6
SWCLK
  Top 0.127: U3.38 47.7,11.9 53.3,11.9 53.3,9.8 53.5,9.6 63.3,9.6 63.3,12.5 64.3,13.5 65.6,13.5 J1.5
SWDIO
  Top 0.127: U3.37 47.7,11.5 49.1,11.5 49.2,11.6 53,11.6 53,9.7 53.7,9 68.7,9 68.7,15.4 67.6,16.5 65.6,16.5 J1.3
V-OUT  (via drill 0.3)
  Top 0.406: R5.P$2 61.5,24.1 v61.4,24.2
  pour Top (no thermals): 31.4,44.8 69.8,44.8 69.8,23.8 37.4,23.8 37.4,30 42.8,30 42.8,33.4 31.4,33.4
  pour Route2 (no thermals): 31.4,44.6 69.6,44.6 69.6,23.8 37.4,23.8 37.4,30 42.8,30 42.8,33.4 31.4,33.4
VCC  (via drill 0.3)
  Top 0.254: U2.4 14,8.35 v14,9 | C11.P$1 46.65,8.65 v46.7,8.7 | v47,5.9 46.95,5.85 C4.P$1 44.69,5.85 U6.3 | C10.P$1 49.25,17.75 v49.2,17.8 | C14.P$1 38.75,14.45 v38.7,14.5 38.7,13.85 C14.P$1
  Top 0.305: U3.20 38.75,13.45 C14.P$1 | C13.P$1 39.6,12.95 39.65,12.95 | 39.65,12.95 U3.21 | U3.23 39.9,11.95 C12.P$1 | 39.65,12.95 v39.8,12.8 | U3.48 49.2,16.95 C10.P$1 | U3.35 46.45,9.4 C11.P$1
  Top 0.406: C12.P$1 39.2,11.15 v39.2,10.4 | R1.P$2 v59.4,19 | R2.P$2 v59.4,17.2 | R10.P$2 61.2,8 v61.3,7.9 | J1.6 68.05,12.05 v68.1,12.1
  other vias: 14,5.4 14,4.6 14,3.8 16.6,4.4 17.4,4.4 18.2,4.4 18.6,5.2 51.2,14.9 51.2,14.1 51.2,13.3
  pour Route15 (no thermals): 0.2,34 23.2,34 23.2,33.2 18.2,33.2 18.2,12 26,12 31,17 37,17 43.2,21.2 69.8,21.2 69.8,0.2 0.2,0.2
  pour Top (no thermals): 13.6,6 19,6 19,3.2 13.6,3.2
  pour Top (no thermals): 50.8,15.4 52.8,15.4 52.8,12.8 50.8,12.8
VSAMP_IN  (via drill 0.3)
  Top 0.127: v44.5,8.9 44.5,10.7 U3.31 | v38.7,8.9 33.6,14 33.6,14.1 R4.P$2
  Top 0.406: R3.P$1 33.1,14.15 R4.P$2
  Bottom 0.127: v38.7,8.9 v44.5,8.9
VSAMP_OUT  (via drill 0.3)
  Top 0.127: v43.9,8.4 43.9,10.7 U3.30 | v53.8,10.1 60.8,17.1 60.8,19 61.3,19.5 R6.P$2
  Top 0.406: R5.P$1 R6.P$2
  Bottom 0.127: v43.9,8.4 45.6,8.4 47.3,10.1 v53.8,10.1

### Text on the board
tPlace: 12V | moteus / power distribution r2 | jjp@pobox.com | (c) 2019 | IN | GND | 3V